# Altium schematic sheet Extension_connectors.SchDoc: Extension connectors
size A4; Date: 01-DEC-2013; Author: P.A.; CompanyName: STMicroelectronics; Organization: Microcontrollers Division; Address1: 12, Rue Jules HOROWITZ; Address2: 38019 Grenoble; Address3: FRANCE; DocumentNumber: MB1209; Revision: D-02; SheetNumber: 9; SheetTotal: 11; Project: STM32F412G-DISCO; PageSetup: Record=PageOptions|CenterHorizontal=True|CenterVertical=True|PrintScale=1.38|XCorrection=1.00|YCorrection=1.00|PrintKind=1|BorderSize=5000000|LeftOffset=0|BottomOffset=0|Orientation=2|PaperLength=1000|PaperWidth=1000|Scale=100|PaperSource=15|PrintQuality=600|MediaType=1|DitherType=10|PaperKind=A3|PrintScaleMode=1; ModifiedDate: 6/2/2016
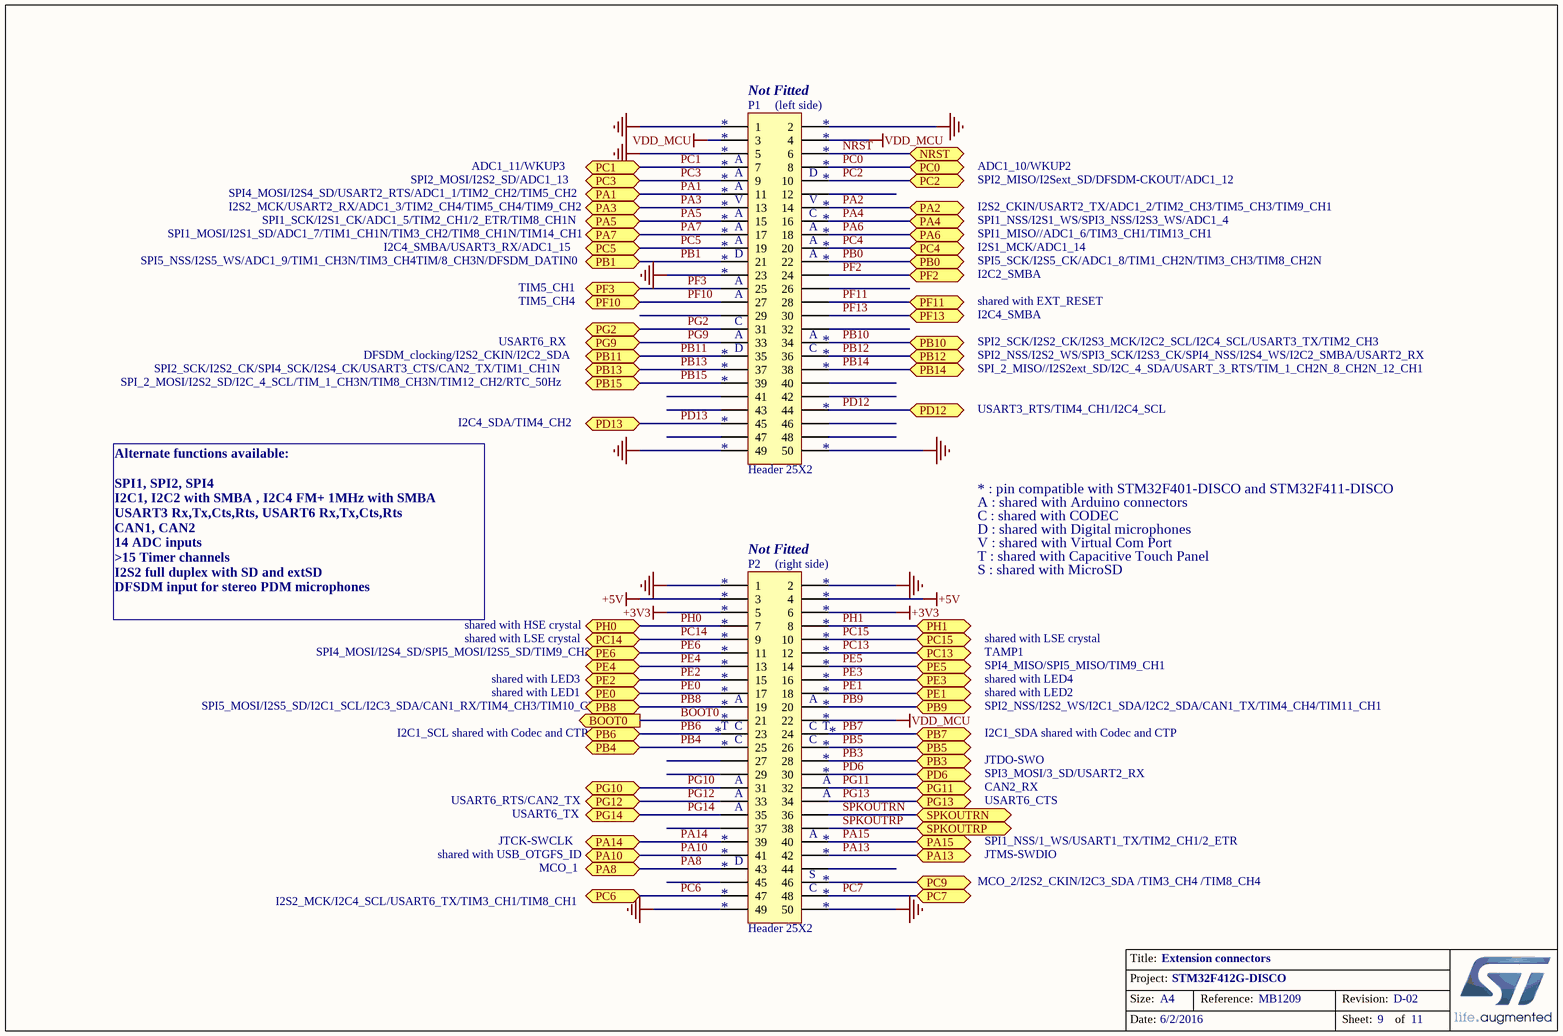
[diagram p0: Extension_connectors.SchDoc]

## Parts
P1  Header 25X2  [HDR_2X25_2R54_W]
P2  Header 25X2  [HDR_2X25_2R54_W]

## Ports
BOOT0 (out), NRST, PA1, PA2, PA3, PA4, PA5, PA6, PA7, PA8, PA10, PA13, PA14, PA15, PB0, PB1, PB3, PB4, PB5, PB6, PB7, PB8, PB9, PB10, PB11, PB12, PB13, PB14, PB15, PC0, PC1, PC2, PC3, PC4, PC5, PC6, PC7, PC9 (bidir), PC13, PC14, PC15, PD6, PD12, PD13, PE0, PE1, PE2, PE3, PE4, PE5, PE6, PF2, PF3, PF10, PF11, PF13, PG2, PG9, PG10, PG11, PG12, PG13, PG14, PH0, PH1, SPKOUTRN, SPKOUTRP

## Nets
+3V3: P2.5 P2.6
+5V: P2.3 P2.4
GND: P1.1 P1.2 P1.5 P1.23 P1.49 P1.50 P2.1 P2.2 P2.49 P2.50
VDD_MCU: P1.3 P1.4 P2.22
BOOT0: P2.21 ; port BOOT0
NRST: P1.6 ; port NRST
PA1: P1.11 ; port PA1
PA2: P1.14 ; port PA2
PA3: P1.13 ; port PA3
PA4: P1.16 ; port PA4
PA5: P1.15 ; port PA5
PA6: P1.18 ; port PA6
PA7: P1.17 ; port PA7
PA8: P2.43 ; port PA8
PA10: P2.41 ; port PA10
PA13: P2.42 ; port PA13
PA14: P2.39 ; port PA14
PA15: P2.40 ; port PA15
PB0: P1.22 ; port PB0
PB1: P1.21 ; port PB1
PB3: P2.28 ; port PB3
PB4: P2.25 ; port PB4
PB5: P2.26 ; port PB5
PB6: P2.23 ; port PB6
PB7: P2.24 ; port PB7
PB8: P2.19 ; port PB8
PB9: P2.20 ; port PB9
PB10: P1.34 ; port PB10
PB11: P1.35 ; port PB11
PB12: P1.36 ; port PB12
PB13: P1.37 ; port PB13
PB14: P1.38 ; port PB14
PB15: P1.39 ; port PB15
PC0: P1.8 ; port PC0
PC1: P1.7 ; port PC1
PC2: P1.10 ; port PC2
PC3: P1.9 ; port PC3
PC4: P1.20 ; port PC4
PC5: P1.19 ; port PC5
PC6: P2.47 ; port PC6
PC7: P2.48 ; port PC7
PC9: P2.46 ; port PC9
PC13: P2.12 ; port PC13
PC14: P2.9 ; port PC14
PC15: P2.10 ; port PC15
PD6: P2.30 ; port PD6
PD12: P1.44 ; port PD12
PD13: P1.45 ; port PD13
PE0: P2.17 ; port PE0
PE1: P2.18 ; port PE1
PE2: P2.15 ; port PE2
PE3: P2.16 ; port PE3
PE4: P2.13 ; port PE4
PE5: P2.14 ; port PE5
PE6: P2.11 ; port PE6
PF2: P1.24 ; port PF2
PF3: P1.25 ; port PF3
PF10: P1.27 ; port PF10
PF11: P1.28 ; port PF11
PF13: P1.30 ; port PF13
PG2: P1.31 ; port PG2
PG9: P1.33 ; port PG9
PG10: P2.31 ; port PG10
PG11: P2.32 ; port PG11
PG12: P2.33 ; port PG12
PG13: P2.34 ; port PG13
PG14: P2.35 ; port PG14
PH0: P2.7 ; port PH0
PH1: P2.8 ; port PH1
SPKOUTRN: P2.36 ; port SPKOUTRN
SPKOUTRP: P2.38 ; port SPKOUTRP

Not connected (* = marked no-connect by the designer): P1 12 26 29 32 40 41 42 43 46 47 48; P2 27 29 37 44 45

## Notes on the sheet
- (near P1) Not Fitted
- (near P1) (left side)
- ADC1_11/WKUP3
- (near P1) *
- (near P1) A
- (near P1) D
- ADC1_10/WKUP2
- SPI1_MOSI/I2S1_SD/ADC1_7/TIM1_CH1N/TIM3_CH2/TIM8_CH1N/TIM14_CH1
- SPI4_MOSI/I2S4_SD/USART2_RTS/ADC1_1/TIM2_CH2/TIM5_CH2
- I2S2_MCK/USART2_RX/ADC1_3/TIM2_CH4/TIM5_CH4/TIM9_CH2
- SPI1_SCK/I2S1_CK/ADC1_5/TIM2_CH1/2_ETR/TIM8_CH1N
- I2C4_SMBA/USART3_RX/ADC1_15
- SPI2_MOSI/I2S2_SD/ADC1_13
- (near P1) V
- (near P1) C
- I2S1_MCK/ADC1_14
- SPI1_MISO//ADC1_6/TIM3_CH1/TIM13_CH1
- SPI1_NSS/I2S1_WS/SPI3_NSS/I2S3_WS/ADC1_4
- SPI2_MISO/I2Sext_SD/DFSDM-CKOUT/ADC1_12
- I2S2_CKIN/USART2_TX/ADC1_2/TIM2_CH3/TIM5_CH3/TIM9_CH1
- SPI5_NSS/I2S5_WS/ADC1_9/TIM1_CH3N/TIM3_CH4TIM/8_CH3N/DFSDM_DATIN0
- TIM5_CH1
- TIM5_CH4
- I2C2_SMBA
- SPI5_SCK/I2S5_CK/ADC1_8/TIM1_CH2N/TIM3_CH3/TIM8_CH2N
- shared with EXT_RESET
- SPI_2_MOSI/I2S2_SD/I2C_4_SCL/TIM_1_CH3N/TIM8_CH3N/TIM12_CH2/RTC_50Hz
- SPI2_SCK/I2S2_CK/SPI4_SCK/I2S4_CK/USART3_CTS/CAN2_TX/TIM1_CH1N
- DFSDM_clocking/I2S2_CKIN/I2C2_SDA
- USART6_RX
- SPI2_SCK/I2S2_CK/I2S3_MCK/I2C2_SCL/I2C4_SCL/USART3_TX/TIM2_CH3
- SPI_2_MISO//I2S2ext_SD/I2C_4_SDA/USART_3_RTS/TIM_1_CH2N_8_CH2N_12_CH1
- SPI2_NSS/I2S2_WS/SPI3_SCK/I2S3_CK/SPI4_NSS/I2S4_WS/I2C2_SMBA/USART2_RX
- I2C4_SMBA
- I2C4_SDA/TIM4_CH2
- USART3_RTS/TIM4_CH1/I2C4_SCL
- * : pin compatible with STM32F401-DISCO and STM32F411-DISCO
- A : shared with Arduino connectors
- C : shared with CODEC
- (near P2) Not Fitted
- (near P2) (right side)
- D : shared with Digital microphones
- V : shared with Virtual Com Port
- T : shared with Capacitive Touch Panel
- S : shared with MicroSD
- Alternate functions available:
  SPI1, SPI2, SPI4
  I2C1, I2C2 with SMBA , I2C4 FM+ 1MHz with SMBA
  USART3 Rx,Tx,Cts,Rts, USART6 Rx,Tx,Cts,Rts
  CAN1, CAN2
  14 ADC inputs
  >15 Timer channels
  I2S2 full duplex with SD and extSD
  DFSDM input for stereo PDM microphones
- SPI4_MOSI/I2S4_SD/SPI5_MOSI/I2S5_SD/TIM9_CH2
- shared with LSE crystal
- shared with HSE crystal
- (near P2) *
- TAMP1
- SPI5_MOSI/I2S5_SD/I2C1_SCL/I2C3_SDA/CAN1_RX/TIM4_CH3/TIM10_CH1
- shared with LED3
- shared with LED1
- (near P2) A
- SPI4_MISO/SPI5_MISO/TIM9_CH1
- SPI2_NSS/I2S2_WS/I2C1_SDA/I2C2_SDA/CAN1_TX/TIM4_CH4/TIM11_CH1
- shared with LED4
- shared with LED2
- I2C1_SCL shared with Codec and CTP
- (near P2) T
- (near P2) C
- SPI3_MOSI/3_SD/USART2_RX
- CAN2_RX
- JTDO-SWO
- I2C1_SDA shared with Codec and CTP
- USART6_RTS/CAN2_TX
- JTCK-SWCLK
- USART6_TX
- SPI1_NSS/1_WS/USART1_TX/TIM2_CH1/2_ETR
- USART6_CTS
- I2S2_MCK/I2C4_SCL/USART6_TX/TIM3_CH1/TIM8_CH1
- shared with USB_OTGFS_ID
- MCO_1
- (near P2) D
- (near P2) S
- MCO_2/I2S2_CKIN/I2C3_SDA /TIM3_CH4 /TIM8_CH4
- JTMS-SWDIO
- Title:
- Project:
- Size:
- Date:
- A4
- Reference:
- Sheet:
- Revision:
- of

## Library data of the parts
P1 P2 = Header 25X2: Header, 25-Pin, Dual row; Ordered by: Subcon; Fitted: NO; ECCN_US/EU: NA; LatestRevisionDate: 17-Jul-2002; LatestRevisionNote: Re-released for DXP Platform.; Publisher: Altium Limited